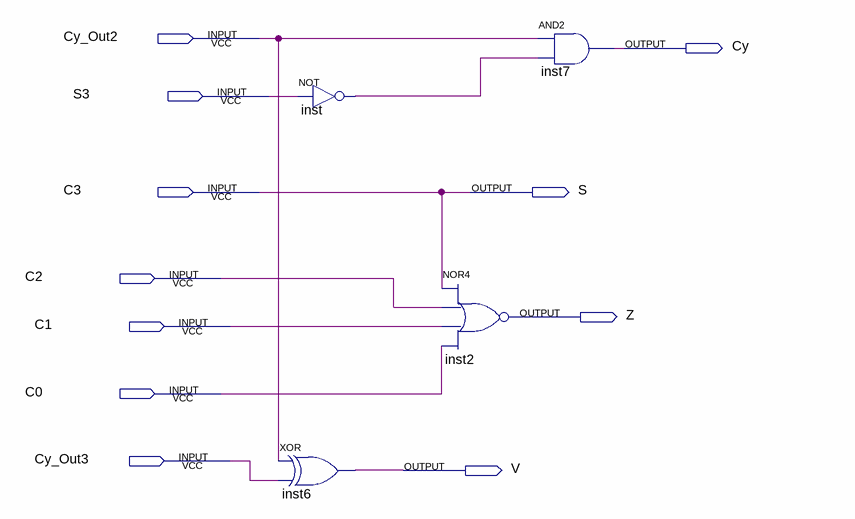
[diagram p0: schematic sheet]
// Quartus schematic state4bit.bdf as structural Verilog: 4 symbols, 11 pins
module state4bit (
  input  Cy_Out2,
  input  S3,
  input  C3,
  input  C2,
  input  C1,
  input  C0,
  input  Cy_Out3,
  output Cy,
  output S,
  output Z,
  output V
);

  wire inst_out;

  not inst (inst_out, S3);
  xor inst6 (V, Cy_Out2, Cy_Out3);
  nor inst2 (Z, C3, C2, C1, C0);
  and inst7 (Cy, Cy_Out2, inst_out);

  assign S = C3;
endmodule
